# EAGLE schematic CPU_board (EAGLE 9.4.2)
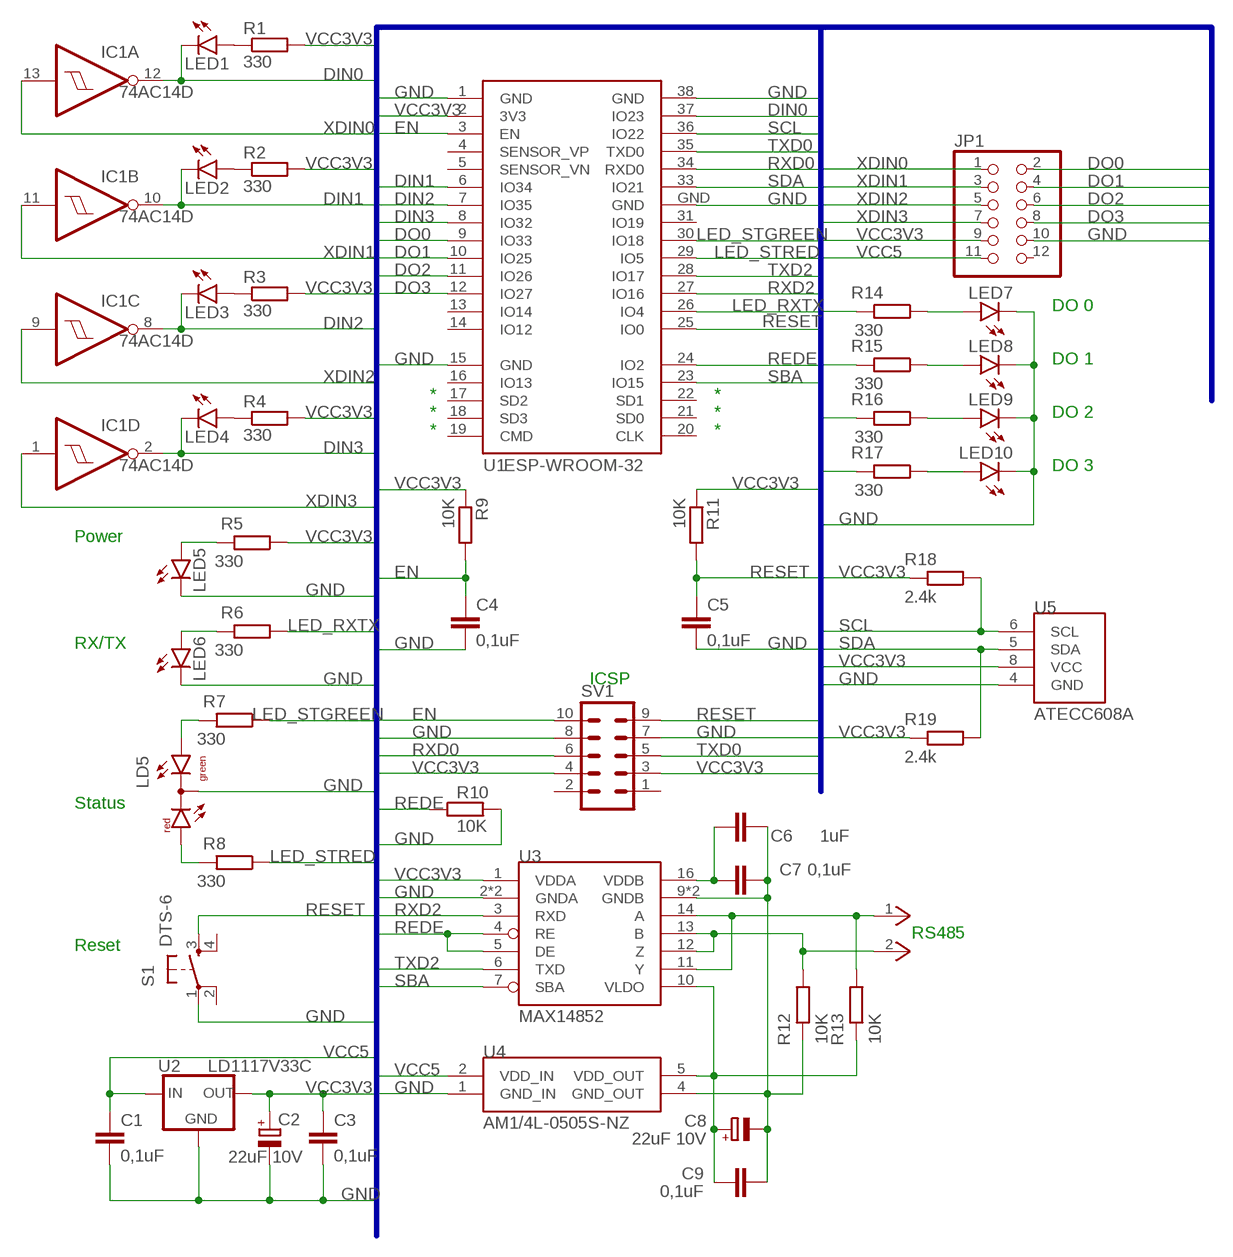
[diagram p0: schematic, sheet 1]

## Parts
C1  0,1uF  C-EUC0603  [C0603]
C2  22uF 10V  CPOL-EUA  [PANASONIC_A]
C3  0,1uF  C-EUC0603  [C0603]
C4  0,1uF  C-EUC0603  [C0603]
C5  0,1uF  C-EUC0603  [C0603]
C6  1uF  C-EUC0603  [C0603]
C7  0,1uF  C-EUC0603  [C0603]
C8  22uF 10V  CPOL-EUD  [PANASONIC_D]
C9  0,1uF  C-EUC0603  [C0603]
IC1  74AC14D  [SO14]
JP1  PINHD-2X6  [2X06]
LD5  DUOLED-RG-C  [DUOLED-C-5MM]
LED1  LED5MM  [LED5MM]
LED2  LED5MM  [LED5MM]
LED3  LED5MM  [LED5MM]
LED4  LED5MM  [LED5MM]
LED5  LED5MM  [LED5MM]
LED6  LED5MM  [LED5MM]
LED7  LED5MM  [LED5MM]
LED8  LED5MM  [LED5MM]
LED9  LED5MM  [LED5MM]
LED10  LED5MM  [LED5MM]
R1  330  R-EU_R0603  [R0603]
R2  330  R-EU_R0603  [R0603]
R3  330  R-EU_R0603  [R0603]
R4  330  R-EU_R0603  [R0603]
R5  330  R-EU_R0603  [R0603]
R6  330  R-EU_R0603  [R0603]
R7  330  R-EU_R0603  [R0603]
R8  330  R-EU_R0603  [R0603]
R9  10K  R-EU_R0603  [R0603]
R10  10K  R-EU_R0603  [R0603]
R11  10K  R-EU_R0603  [R0603]
R12  10K  R-EU_R0603  [R0603]
R13  10K  R-EU_R0603  [R0603]
R14  330  R-EU_R0603  [R0603]
R15  330  R-EU_R0603  [R0603]
R16  330  R-EU_R0603  [R0603]
R17  330  R-EU_R0603  [R0603]
R18  2.4k  R-EU_R0603  [R0603]
R19  2.4k  R-EU_R0603  [R0603]
S1  DTS-6  [DTS-6]
SV1  ML10  [ML10]
U1  ESP-WROOM-32  [ESP-WROOM-32]
U2  LD1117V33C  [SOT223]
U3  MAX14852  [SO16]
U4  AM1/4L-0505S-NZ  AM1/4L  [AM1/4L]
U5  ATECC608A  [SOIC8]
X1  2EHDCR-5.08-02P  [2EHDCR-5.08-02P]

## Nets
DIN0: IC1.12(A:O) LED1.K(C) U1.37(IO23)
DIN1: IC1.10(B:O) LED2.K(C) U1.6(IO34)
DIN2: IC1.8(C:O) LED3.K(C) U1.7(IO35)
DIN3: IC1.2(D:O) LED4.K(C) U1.8(IO32)
DO0: JP1.2 R14.2 U1.9(IO33)
DO1: JP1.4 R15.2 U1.10(IO25)
DO2: JP1.6 R16.2 U1.11(IO26)
DO3: JP1.8 R17.2 U1.12(IO27)
EN: C4.1 R9.2 SV1.10 U1.3(EN)
GND: C1.2 C2.- C3.2 C4.2 C5.2 JP1.10 LD5.C LED5.K(C) LED6.K(C) LED7.K(C) LED8.K(C) LED9.K(C) LED10.K(C) R10.2 S1.1 SV1.7 SV1.8 U1.1(GND) U1.15(GND) U1.38(GND) U1.GND U2.1(GND) U3.2(GNDA) U3.8(GNDA) U4.1(GND_IN) U5.4(GND)
LED_RXTX: R6.1 U1.26(IO4)
LED_STGREEN: R7.1 U1.30(IO18)
LED_STRED: R8.1 U1.29(IO5)
N$1: LED1.A R1.1
N$2: LED10.A R17.1
N$3: LED9.A R16.1
N$4: LED8.A R15.1
N$5: LED7.A R14.1
N$6: LED2.A R2.1
N$7: LED3.A R3.1
N$8: LED4.A R4.1
N$9: LED6.A R6.2
N$10: LD5.AX(AG) R7.2
N$11: LD5.AR R8.2
N$12: LED5.A R5.2
N$13: C8.+ C9.1 R13.2 U3.10(VLDO) U4.5(VDD_OUT)
N$14: C6.2 C7.2 C8.- C9.2 R12.2 U3.9(GNDB) U3.15(GNDB) U4.4(GND_OUT)
N$15: C6.1 C7.1 U3.16(VDDB)
N$16: R13.1 U3.11(Y) U3.14(A) X1.1
N$17: R12.1 U3.12(Z) U3.13(B) X1.2
REDE: R10.1 U1.24(IO2) U3.4(RE) U3.5(DE)
RESET: C5.1 R11.2 S1.3 SV1.9 U1.25(IO0)
RXD0: SV1.6 U1.34(RXD0)
RXD2: U1.27(IO16) U3.3(RXD)
SBA: U1.23(IO15) U3.7(SBA)
SCL: R18.1 U1.36(IO22) U5.6(SCL)
SDA: R19.1 U1.33(IO21) U5.5(SDA)
TXD0: SV1.5 U1.35(TXD0)
TXD2: U1.28(IO17) U3.6(TXD)
VCC3V3: C2.+ C3.1 JP1.9 R1.2 R2.2 R3.2 R4.2 R5.1 R9.1 R11.1 R18.2 R19.2 SV1.3 SV1.4 U1.2(3V3) U2.2(OUT) U2.4(OUT) U3.1(VDDA) U5.8(VCC)
VCC5: C1.1 JP1.11 U2.3(IN) U4.2(VDD_IN)
XDIN0: IC1.13(A:I) JP1.1
XDIN1: IC1.11(B:I) JP1.3
XDIN2: IC1.9(C:I) JP1.5
XDIN3: IC1.1(D:I) JP1.7
Unconnected: IC1.3(E:I) IC1.4(E:O) IC1.5(F:I) IC1.6(F:O) JP1.12 S1.2 S1.4 SV1.1 SV1.2 U1.4(SENSOR_VP) U1.5(SENSOR_VN) U1.13(IO14) U1.14(IO12) U1.16(IO13) U1.17(SD2) U1.18(SD3) U1.19(CMD) U1.20(CLK) U1.21(SD0) U1.22(SD1) U1.31(IO19)

## Buses
DIN0,DIN1,DIN2,DIN3,DO0,DO1,DO2,DO3,EN,GND,ID0,LED_PWR,LED_RXTX,LED_STGREEN,LED_STRED,REDE,RESET,RXD0,RXD2,SBA,SCL,SDA,TXD0,TXD2,VCC3V3,VCC5,XDIN0,XDIN1,XDIN2,XDIN3

## Notes on the sheet
- DO 0
- DO 1
- * | *
- * | * | DO 2
- * | *
- DO 3
- Power
- RX/TX
- ICSP
- Status
- RS485
- Reset

## Power pins joined to a net without a drawn wire
GND: IC1.7(P:GND)
VCC: IC1.14(P:VCC)

## Library data of the parts
C1 C3-C7 C9 = rcl:C-EU: CAPACITOR, European symbol; SPICEPREFIX: C
C2 C8 = rcl:CPOL-EU: POLARIZED CAPACITOR, European symbol; SPICEPREFIX: C
IC1 = 74xx-eu:74*14: Hex schmitt trigger INVERTER
JP1 = pinhead:PINHD-2X6: PIN HEADER
LD5 = led:DUOLED-RG-C: DUO LED 2 colors (red/green), 5 mm, round, common Cathode www.ligitek.com or other producers.
LED1-LED10 = led:LED: LED OSRAM: - CHIPLED LG R971, LG N971, LY N971, LG Q971, LY Q971, LO R971, LY R971 LH N974, LH R974 LS Q976, LO Q976, LY Q976 LO Q996 - Hyper CHIPLED LW Q18S LB Q993, LB Q99A, LB R99A - SideLED LS A670, LO A670, LY A670, LG A670, LP A670 LB A673, LV A673, LT A673, LW A673 LH A674 LY A675 LS A676, LA A676, LO A676, LY A676, LW A676 LS A679, LY A679, LG A679 - Hyper Micro SIDELED® LS Y876, LA Y876, LO Y876, LY Y876 LT Y87S - SmartLED LW L88C, LW L88S LB L89C, LB L89S, LG L890 LS L89K, LO L89K, LY L89K LS L896, LA L896, LO L896, LY L896 - TOPLED LS T670, LO T670, LY T670, LG T670, LP T670 LSG T670, LSP T670, LSY T670, LOP T670, LYG T670 LG T671, LOG T671, LSG T671 LB T673, LV T673, LT T673, LW T673 LH T674 LS T676, LA T676, LO T676, LY T676, LB T676, LH T676, LSB T676, LW T676 LB T67C, LV T67C, LT T67C, LS T67K, LO T67K, LY T67K, LW E67C LS E67B, LA E67B, LO E67B, LY E67B, LB E67C, LV E67C, LT E67C LW T67C LS T679, LY T679, LG T679 LS T770, LO T770, LY T770, LG T770, LP T770 LB T773, LV T773, LT T773, LW T773 LH T774 LS E675, LA E675, LY E675, LS T675 LS T776, LA T776, LO T776, LY T776, LB T776 LHGB T686 LT T68C, LB T68C - Hyper Mini TOPLED® LB M676 - Mini TOPLED Santana® LG M470 LS M47K, LO M47K, LY M47K Source: http://www.osram.convergy.de LUXEON: - LUMILED® LXK2-PW12-R00, LXK2-PW12-S00, LXK2-PW14-U00, LXK2-PW14-V00 LXK2-PM12-R00, LXK2-PM12-S00, LXK2-PM14-U00 LXK2-PE12-Q00, LXK2-PE12-R00, LXK2-PE12-S00, LXK2-PE14-T00, LXK2-PE14-U00 LXK2-PB12-K00, LXK2-PB12-L00, LXK2-PB12-M00, LXK2-PB14-N00, LXK2-PB14-P00, LXK2-PB14-Q00 LXK2-PR12-L00, LXK2-PR12-M00, LXK2-PR14-Q00, LXK2-PR14-R00 LXK2-PD12-Q00, LXK2-PD12-R00, LXK2-PD12-S00 LXK2-PH12-R00, LXK2-PH12-S00 LXK2-PL12-P00, LXK2-PL12-Q00, LXK2-PL12-R00 Source: www.luxeon.com KINGBRIGHT: KA-3528ASYC Source: www.kingbright.com
R1-R19 = rcl:R-EU_: RESISTOR, European symbol; SPICEPREFIX: R
S1 = switch-tact:DTS-6
SV1 = con-harting-ml:ML10: HARTING; OC_FARNELL: unknown; OC_NEWARK: unknown
U1 = esp32:ESP-WROOM-32: Espressif Systems ESP-WROOM-32
U2 = LD1117V33:LD1117V33C
U3 = Main-board:MAX14852
U4 = Main-board:AM1/4L
U5 = atecc:ATECC608A
X1 = Main-board:2EHDCR-5.08-02P